# EAGLE schematic Motor driver (EAGLE 6.3)
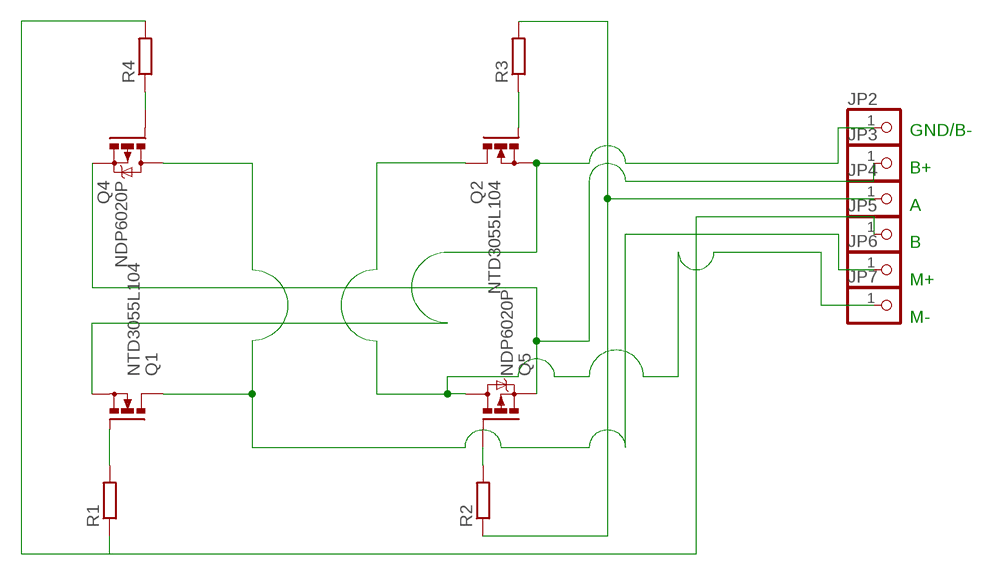
[diagram p0: schematic, sheet 1]

## Parts
JP2  PINHD-1X1  [1X01]
JP3  PINHD-1X1  [1X01]
JP4  PINHD-1X1  [1X01]
JP5  PINHD-1X1  [1X01]
JP6  PINHD-1X1  [1X01]
JP7  PINHD-1X1  [1X01]
Q1  NTD3055L104  [TO220BV]
Q2  NTD3055L104  [TO220BV]
Q4  NDP6020P  IRF9530  [TO220BV]
Q5  NDP6020P  IRF9530  [TO220BV]
R1  R-EU_0204/2V  [0204V]
R2  R-EU_0204/2V  [0204V]
R3  R-EU_0204/2V  [0204V]
R4  R-EU_0204/2V  [0204V]

## Nets
N$1: Q4.G R4.1
N$2: Q2.G R3.1
N$3: Q1.G R1.2
N$4: Q5.G R2.2
N$5: JP5.1 R1.1 R4.2
N$6: JP4.1 R2.1 R3.2
N$7: JP3.1 Q4.S Q5.S
N$8: JP2.1 Q1.S Q2.S
N$9: JP6.1 Q1.D Q4.D
N$10: JP7.1 Q2.D Q5.D

## Notes on the sheet
- GND/B-
  
  B+
  
  A
  
  B
  
  M+
  
  M-

## Library data of the parts
JP2-JP7 = pinhead:PINHD-1X1: PIN HEADER
Q1 Q2 = custom:NTD3055L104
Q4 Q5 = transistor-power:IRF9530: P-CHANNEL HEXFET POWER-MOS-FET Source: http://www.irf.com/product-info/datasheets/data/irf9530.pdf
R1-R4 = rcl:R-EU_: RESISTOR, European symbol